# EAGLE schematic exterior_enclosure (EAGLE 7.0.0)
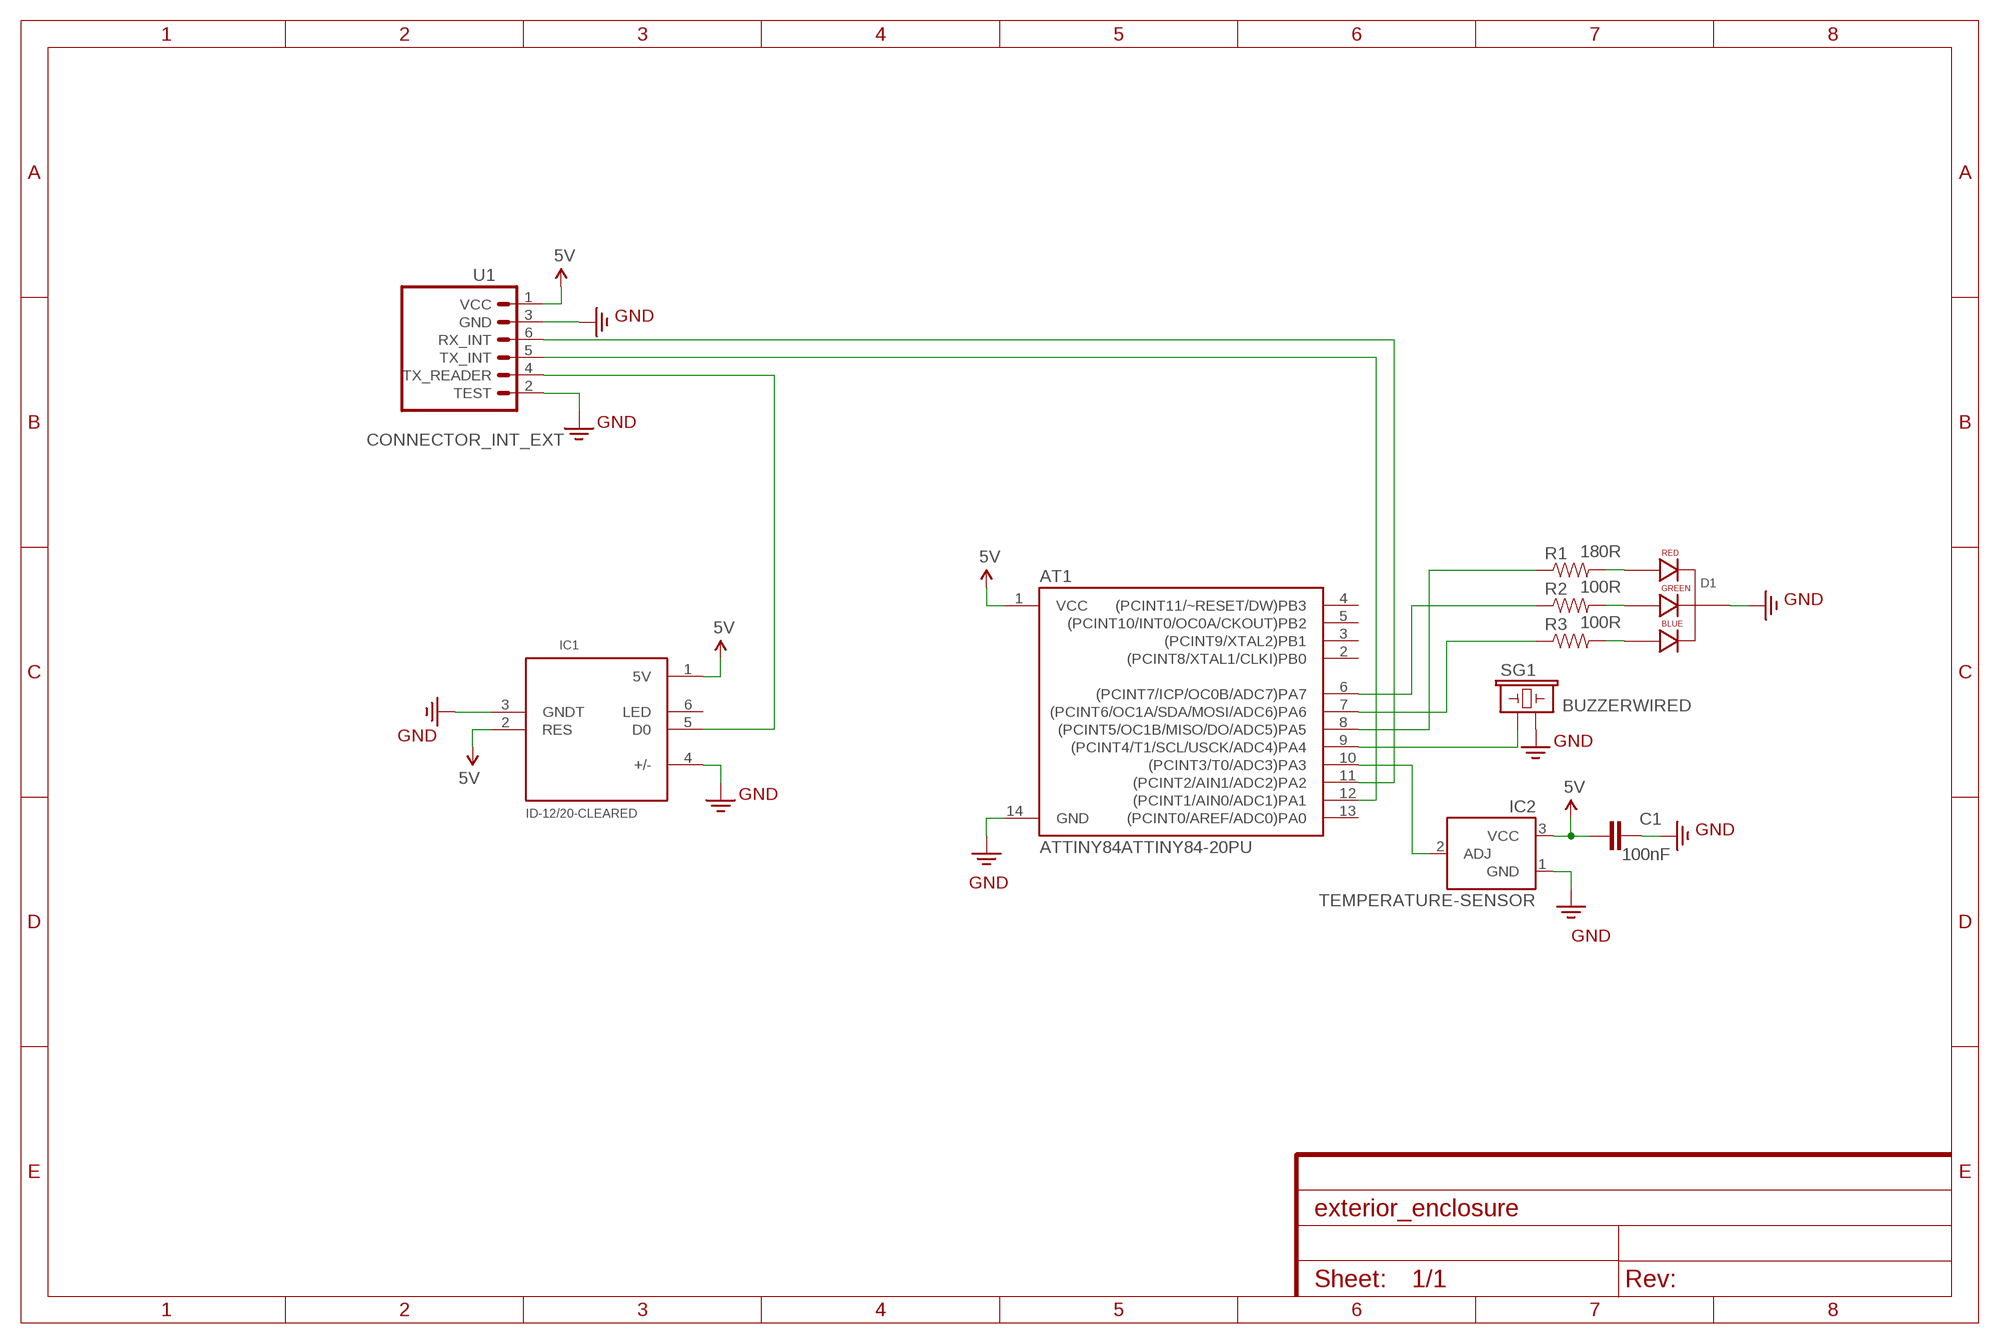
[diagram p0: schematic, sheet 1]
FRAME1 (FRAME-A4L): CNAME: EXTERIOR ENCLOSURE SCHEMATIC; CREVISION: 1.0; DESIGNER: nerdvellous

## Parts
AT1  ATTINY84ATTINY84-20PU  [DIL14]
C1  100nF  0.1UF-50V-20%(PTH)KIT-EZ  [CAP-PTH-SMALL-KIT]
D1  LED-RGB-CC-THRUCLEAR  [LED-RGB-THRU]
IC1  ID-12/20-CLEARED  [1X06_COMMON]
IC2  TEMPERATURE-SENSOR  [TO-92]
R1  180R  RESISTORVERT  [AXIAL-0.1]
R2  100R  RESISTORVERT  [AXIAL-0.1]
R3  100R  RESISTORVERT  [AXIAL-0.1]
SG1  BUZZERWIRED  [1X02]
U1  CONNECTOR_INT_EXT  [1X06_COMMON]

## Nets
5V: AT1.1(VCC) C1.1 IC1.1(5V) IC1.2(RES) IC2.3(VCC) U1.1(VCC)
GND: AT1.14(GND) C1.2 D1.2(CATHODE) IC1.3(GNDT) IC1.4(+/-) IC2.1(GND) SG1.2 U1.2(TEST) U1.3(GND)
N$1: D1.1(RED_CATHODE) R1.P$2
N$2: D1.3(GREEN_CATHODE) R2.P$2
N$3: D1.4(BLUE_CATHODE) R3.P$2
N$4: AT1.10((PCINT3/T0/ADC3)PA3) IC2.2(ADJ)
N$5: AT1.7((PCINT6/OC1A/SDA/MOSI/ADC6)PA6) R3.P$1
N$6: AT1.8((PCINT5/OC1B/MISO/DO/ADC5)PA5) R1.P$1
N$7: AT1.6((PCINT7/ICP/OC0B/ADC7)PA7) R2.P$1
N$8: AT1.9((PCINT4/T1/SCL/USCK/ADC4)PA4) SG1.1
N$9: AT1.11((PCINT2/AIN1/ADC2)PA2) U1.6(RX_INT)
N$10: AT1.12((PCINT1/AIN0/ADC1)PA1) U1.5(TX_INT)
N$11: IC1.5(D0) U1.4(TX_READER)
Unconnected: AT1.2((PCINT8/XTAL1/CLKI)PB0) AT1.3((PCINT9/XTAL2)PB1) AT1.4((PCINT11/~RESET/DW)PB3) AT1.5((PCINT10/INT0/OC0A/CKOUT)PB2) AT1.13((PCINT0/AREF/ADC0)PA0) IC1.6(LED)

## Library data of the parts
AT1 = nerdvellous_house_manager:ATTINY84: Atmel 14-pin 2/4/8kB flash uC
C1 = nerdvellous_house_manager:0.1UF-50V-20%(PTH): CAP-08370; PROD_ID: CAP-08370
D1 = nerdvellous_house_manager:LED-RGB-CC-THRU: RGB Through-hole common cathode LED SparkFun Storefront: COM-00105 (Clear) COM-09264 (Diffuse); PROD_ID: DIO-08418
IC1 = nerdvellous_house_manager:ID-12/20-CLEARED: RFID reader for ID2, ID12, and ID20 Package
IC2 = nerdvellous_house_manager:TEMPERATURE-SENSOR: TO-92 temp sensor
R1-R3 = nerdvellous_house_manager:RESISTOR: Resistor Basic schematic elements and footprints for 0603, 1206, and PTH resistors.
SG1 = nerdvellous_house_manager:BUZZER: Buzzer 12mm Spark Fun Electronics SKU : Comp-Buzzer
U1 = nerdvellous_house_manager:CONNECTOR_INT_EXT